# Altium schematic sheet Page09 WIFI&Bluetooth.SchDoc
size 386 x 246 mm; SheetNumber: 9; SheetTotal: 13
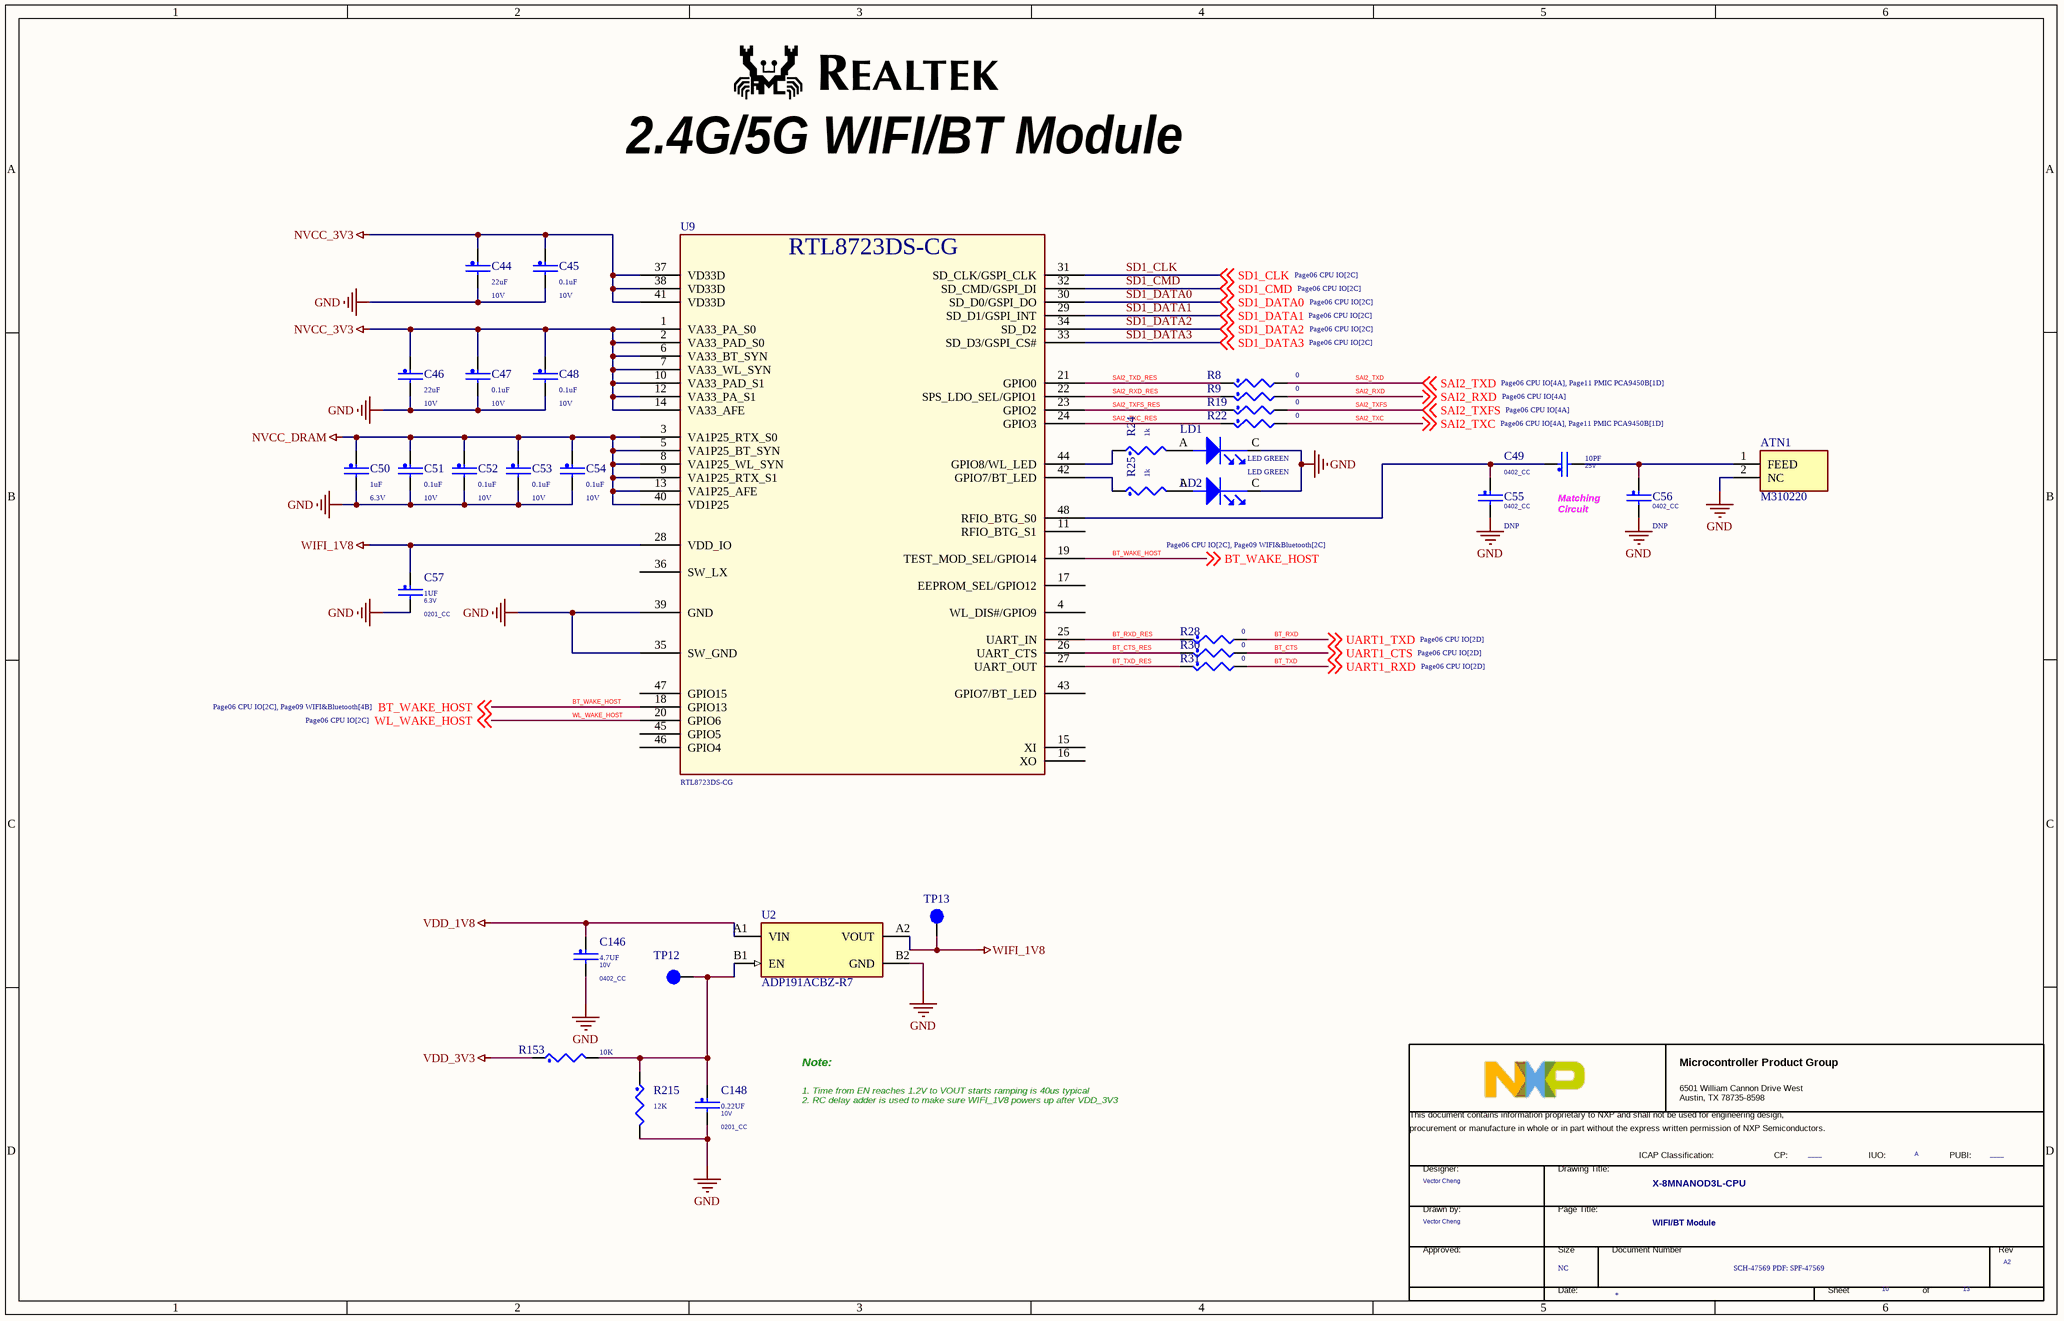
[diagram p0: Page09 WIFI&Bluetooth.SchDoc]

## Parts
*  FCP: ____  FIUO: A  DrawnBy: Vector Cheng  PageTitle: WIFI/BT Module  Page Count: 13  Page Number: 10  Page Size: NC  Title: X-8MNANOD3L-CPU  RevCode: A2  Doc: SCH-47569 PDF: SPF-47569  (hidden comment: TitleBlock_MCPG)  (graphical)
ATN1  M310220  [M310220]
C44  22uF  Voltage: 10V  [0603_CC]
C45  0.1uF  Voltage: 10V  [0201_CC - C]
C46  22uF  Voltage: 10V  [0603_CC]
C47  0.1uF  Voltage: 10V  [0201_CC - C]
C48  0.1uF  Voltage: 10V  [0201_CC - C]
C49  10PF  VOLTAGE: 25V  PCB Footprint: 0402_CC  [0402_CC - C]
C50  1uF  Voltage: 6.3V  [0201_CC - C]
C51  0.1uF  Voltage: 10V  [0201_CC - C]
C52  0.1uF  Voltage: 10V  [0201_CC - C]
C53  0.1uF  Voltage: 10V  [0201_CC - C]
C54  0.1uF  Voltage: 10V  [0201_CC - C]
C55  ASSY_OPT: DNP  PCB Footprint: 0402_CC  [0402_CC - C]  (hidden comment: 10PF)
C56  ASSY_OPT: DNP  PCB Footprint: 0402_CC  [0402_CC - C]  (hidden comment: 10PF)
C57  1UF  PCB Footprint: 0201_CC  VOLTAGE: 6.3V  [0201_CC - C]
C146  4.7UF  PCB Footprint: 0402_CC  VOLTAGE: 10V  [0402_CC - C]
C148  0.22UF  VOLTAGE: 10V  PCB Footprint: 0201_CC  [0201_CC - C]
LD1  LED GREEN  [LED_0603]
LD2  LED GREEN  [LED_0603]
R8  0  [0402_CC_RES]
R9  0  [0402_CC_RES]
R19  0  [0402_CC_RES]
R22  0  [0402_CC_RES]
R24  1k  [0201_RES]
R25  1k  [0201_RES]
R28  0  [0402_CC_RES]
R30  0  [0402_CC_RES]
R31  0  [0402_CC_RES]
R153  10K  [0201_RES]
R215  12K  [0201_RES]
TP12  tpad_020  [Test Pin]  (value not drawn)
TP13  tpad_020  [Test Pin]  (value not drawn)
U2  ADP191ACBZ-R7  [FP-CB-4-3-MFG]
U9  RTL8723DS-CG  [RTL8723DS-CG]

## Nets
GND: ATN1.2(NC) C44.2 C45.2 C46.2 C47.2 C48.2 C50.2 C51.2 C52.2 C53.2 C54.2 C55.2 C56.2 C57.2 C146.2 C148.2 LD1.C(CATHODE) LD2.C(CATHODE) R215.2 U2.B2(GND) U9.35(SW_GND) U9.39(GND)
NVCC_3V3: C44.1 C45.1 C46.1 C47.1 C48.1 U9.1(VA33_PA_S0) U9.2(VA33_PAD_S0) U9.6(VA33_BT_SYN) U9.7(VA33_WL_SYN) U9.10(VA33_PAD_S1) U9.12(VA33_PA_S1) U9.14(VA33_AFE) U9.37(VD33D) U9.38(VD33D) U9.41(VD33D)
NVCC_DRAM: C50.1 C51.1 C52.1 C53.1 C54.1 U9.3(VA1P25_RTX_S0) U9.5(VA1P25_BT_SYN) U9.8(VA1P25_WL_SYN) U9.9(VA1P25_RTX_S1) U9.13(VA1P25_AFE) U9.40(VD1P25)
VDD_1V8: C146.1 U2.A1(VIN)
VDD_3V3: R153.1
WIFI_1V8: C57.1 TP13.1(Pin1) U2.A2(VOUT) U9.28(VDD_IO)
BT_CTS: R30.2 ; off-sheet UART1_CTS  [also labelled UART1_CTS]
BT_CTS_RES: R30.1 U9.26(UART_CTS)
BT_RXD: R28.2 ; off-sheet UART1_TXD  [also labelled UART1_TXD]
BT_RXD_RES: R28.1 U9.25(UART_IN)
BT_TXD: R31.2 ; off-sheet UART1_RXD  [also labelled UART1_RXD]
BT_TXD_RES: R31.1 U9.27(UART_OUT)
BT_WAKE_HOST: U9.18(GPIO13) U9.19(TEST_MOD_SEL/GPIO14) ; off-sheet BT_WAKE_HOST
SAI2_RXD: R9.2 ; off-sheet SAI2_RXD
SAI2_RXD_RES: R9.1 U9.22(SPS_LDO_SEL/GPIO1)
SAI2_TXC: R22.2 ; off-sheet SAI2_TXC
SAI2_TXC_RES: R22.1 U9.24(GPIO3)
SAI2_TXD: R8.2 ; off-sheet SAI2_TXD
SAI2_TXD_RES: R8.1 U9.21(GPIO0)
SAI2_TXFS: R19.2 ; off-sheet SAI2_TXFS
SAI2_TXFS_RES: R19.1 U9.23(GPIO2)
SD1_CLK: U9.31(SD_CLK/GSPI_CLK) ; off-sheet SD1_CLK
SD1_CMD: U9.32(SD_CMD/GSPI_DI) ; off-sheet SD1_CMD
SD1_DATA0: U9.30(SD_D0/GSPI_DO) ; off-sheet SD1_DATA0
SD1_DATA1: U9.29(SD_D1/GSPI_INT) ; off-sheet SD1_DATA1
SD1_DATA2: U9.34(SD_D2) ; off-sheet SD1_DATA2
SD1_DATA3: U9.33(SD_D3/GSPI_CS#) ; off-sheet SD1_DATA3
WL_WAKE_HOST: U9.20(GPIO6) ; off-sheet WL_WAKE_HOST
NetATN1_1: ATN1.1(FEED) C49.2 C56.1
NetC49_1: C49.1 C55.1 U9.48(RFIO_BTG_S0)
NetC148_1: C148.1 R153.2 R215.1 TP12.1(Pin1) U2.B1(EN)
NetLD1_A: LD1.A(ANODE) R24.2
NetLD2_A: LD2.A(ANODE) R25.2
NetR24_1: R24.1 U9.44(GPIO8/WL_LED)
NetR25_1: R25.1 U9.42(GPIO7/BT_LED)

Not connected (* = marked no-connect by the designer): U9 4(WL_DIS#/GPIO9) 11(RFIO_BTG_S1) 15(XI) 16(XO) 17(EEPROM_SEL/GPIO12) 36(SW_LX) 43(GPIO7/BT_LED) 45(GPIO5) 46(GPIO4) 47(GPIO15)

## Notes on the sheet
- 2.4G/5G WIFI/BT Module
- (near C56) Matching
  Circuit
- Note:
- 1. Time from EN reaches 1.2V to VOUT starts ramping is 40us typical
  2. RC delay adder is used to make sure WIFI_1V8 powers up after VDD_3V3
- (in symbol TitleBlock_MCPG) Microcontroller Product Group; 6501 William Cannon Drive West / Austin, TX 78735-8598; This document contains information proprietary to NXP and shall not be used for engineering design,; procurement or manufacture in whole or in part without the express written permission of NXP Semiconductors.; ICAP Classification:; CP:; IUO:; PUBI:; Designer:; Drawing Title:; Drawn by:; Page Title:; Approved:; Size; Document Number; Rev; Date:; Sheet; of

## Library data of the parts
* = TitleBlock_MCPG: OrgAddr1: NO. 192 Liangjing Rd. Pudong New Area, ShangHai; OrgName: NXP Semiconductor; PUBI: ____; Designer: Vector Cheng; Page Create Date: March  8, 1995; Page Modify Date: *
ATN1 = M310220: Antennas Ceramic Chip ANTENNA BT/WLAN 2.4-2.5GHz; Manufacturer_Name: Kyocera AVX; Geometry.Height: 1.18mm; Farnell Part Number: *; Farnell Price/Stock: *; Manufacturer_Part_Number: M310220; Datasheet Link: *
C44-C48 C50-C54 = CAP_NP: CLASS: DISCRETE
C49 C56 = CAP_NP: CAP CER 10PF 25V 5% C0G 0402; CLASS: DISCRETE; MFG_PN01: C0402C0G250-100JNP; MFG_NAME01: VENKEL COMPANY; CAD_APPROVED: Yes; FPLIST: CC0402_25,CC0402_HD,0402_CC; AGILE_PN: 150-30134; ROHS: Yes; Tolerance: 5%; Package Type: 0402; HEIGHT: 0.635 MM; Package Size: Paper Tape (7" Reel)
  C56: VOLTAGE: 25V
C55 = CAP_NP: CAP CER 10PF 25V 5% C0G 0402; CLASS: DISCRETE; AGILE_PN: 150-30134; FPLIST: CC0402_25,CC0402_HD,0402_CC; CAD_APPROVED: Yes; MFG_NAME01: VENKEL COMPANY; MFG_PN01: C0402C0G250-100JNP; Package Size: Paper Tape (7" Reel); HEIGHT: 0.635 MM; Package Type: 0402; Tolerance: 5%; ROHS: Yes; VOLTAGE: 25V
C57 = CAP_NP: CAP CER 1uF 6.3V 20% X5R 0201; CLASS: DISCRETE; FPLIST: CC0201,CC0201_HD,0201_CC,0201_CC_012SM_NSP; CAD_APPROVED: Yes; MFG_PN01: 02016D105MAT2A; MFG_NAME01: AVX; AGILE_PN: 150-79407; Package Type: 7¡± reel; Package Size: 0201; HEIGHT: 0.35MM; ROHS: Yes; Tolerance: 20%
C146 = CAP_NP: CAP CER 4.7uF 10V 10% X5R 0402; CLASS: DISCRETE; AGILE_PN: 150-80044; MFG_NAME01: Samsung Electro Mechanics; MFG_PN01: CL05A475KP5NRNC; CAD_APPROVED: Yes; FPLIST: CC0402_25,CC0402_HD,0402_CC; Tolerance: 10%; ROHS: Yes; HEIGHT: 0.65MM
C148 = CAP_NP: CAP CER 0.22UF 10V 20% X5R 0201; CLASS: DISCRETE; FPLIST: CC0201,CC0201_HD,0201_CC; CAD_APPROVED: Yes; MFG_PN01: LMK063BJ224MP-F; MFG_NAME01: Taiyo Yuden; AGILE_PN: 150-78815; HEIGHT: 0.33MM; ROHS: Yes; Tolerance: 20%
LD1 LD2 = LED: LED GRN SGL 25MA SMT 0603; CLASS: IC; VOLTAGE: 2V; AGILE_PN: 370-76672; MFG_NAME01: DIALIGHT; MFG_PN01: 598-8070-107F; CAD_APPROVED: Yes; ROHS: Yes; HEIGHT: 0.8 MM; PCB Footprint: LED_0603
R8 R9 R19 R22 = RES: RES MF ZERO OHM 1/16W 5% 0402; CLASS: DISCRETE; PCB Footprint: 0402_CC; AGILE_PN: 470-75394; MFG_NAME01: YAGEO AMERICA; MFG_PN01: RC0402JR-070RL; CAD_APPROVED: Yes; FPLIST: RC0402_25,RC0402_HD,RC0402_X2,0402_CC; TOL: 1%; SIGNAL_MODEL: DEFAULT_RESISTOR_10000OHM_2_1; VOLTAGE: 1/16W; Tolerance: 5%; ROHS: Yes; HEIGHT: 0.45 MM
R24 R25 = RES: RES MF 1.0K OHM 1/20W 1% 30V -55+155C 0201; CLASS: DISCRETE; Temp Range: -55¡ãC ~ 155¡ãC; VOLTAGE: 30; FPLIST: RC0201,0201_CC; CAD_APPROVED: Yes; MFG_PN01: CRCW02011K00FNED; MFG_NAME01: VISHAY INTERTECHNOLOGY; AGILE_PN: 470-82221; PCB Footprint: 0201_CC; HEIGHT: 0.28MM; Temp_Range: -55¡ãC ~ 155¡ãC; ROHS: Yes; Tolerance: 1%
R28 R30 R31 = RES: RES MF ZERO OHM 1/16W 5% 0402; CLASS: DISCRETE; AGILE_PN: 470-75394; MFG_NAME01: YAGEO AMERICA; MFG_PN01: RC0402JR-070RL; CAD_APPROVED: Yes; FPLIST: RC0402_25,RC0402_HD,RC0402_X2,0402_CC; TOL: 1%; SIGNAL_MODEL: DEFAULT_RESISTOR_10000OHM_2_1; PCB Footprint: 0402_CC; VOLTAGE: 1/16W; Tolerance: 5%; ROHS: Yes; HEIGHT: 0.45 MM
R153 = RES: RES MF 10K 1/20W 5% 0201; CLASS: DISCRETE; FPLIST: RC0201,0201_CC; CAD_APPROVED: Yes; MFG_PN01: RTT01103JTH; MFG_NAME01: RALEC ELECTRONIC CORP; AGILE_PN: 470-79719; PCB Footprint: 0201_CC; HEIGHT: 0.26 MM; ROHS: Yes; Tolerance: 5%
R215 = RES: RES MF 12K 1/20W 1% 0201; CLASS: DISCRETE; PCB Footprint: 0201_CC; MFG_PN01: RC-0201-123FT; MFG_NAME01: SKYMOS; CAD_APPROVED: Yes; FPLIST: RC0201,0201_CC; AGILE_PN: 470-77701; VOLTAGE: 1/20W; ROHS: Yes; Tolerance: 1%; HEIGHT: 0.26MM
TP12 TP13 = TESTLOOP: TEST POINT PAD 0.5MM DIA SMT, NO PART TO ORDER; CLASS: IO; CAD_APPROVED: Yes; AGILE_PN: 211-77484; PCB Footprint: tpad_020; HEIGHT: 0.1MM; ROHS: Yes
U2 = CMP-09138-000080-1: IC PWR SWITCH P-CHAN 1:1 4WLCSP; Nominal Supply Current: 500mA; Output Configuration: High Side; Max Power Dissipation: 7.2uW; Min Input Voltage: 1.1V; Operating Supply Current: 2uA; On-State Resistance: 105mR; Max Input Voltage: 3.6V; Number of Outputs: 1; Interface: On/Off; Lead Free: Contains Lead; RoHS Compliant: Yes; Number of Pins: 4; Output Current: 500mA; Min Operating Temperature: -40°C; Mount: Surface Mount; Supply Current: 500mA; Package Quantity: 1; Radiation Hardening: No; Max Output Current: 500mA; Max Supply Current: 500mA; REACH SVHC: No SVHC; Max Operating Temperature: 85°C; Packaging: Tape and Reel; Series: -; Operating Supply Voltage: 3.6V